# EAGLE design StellixR1 (EAGLE 9.2.0)
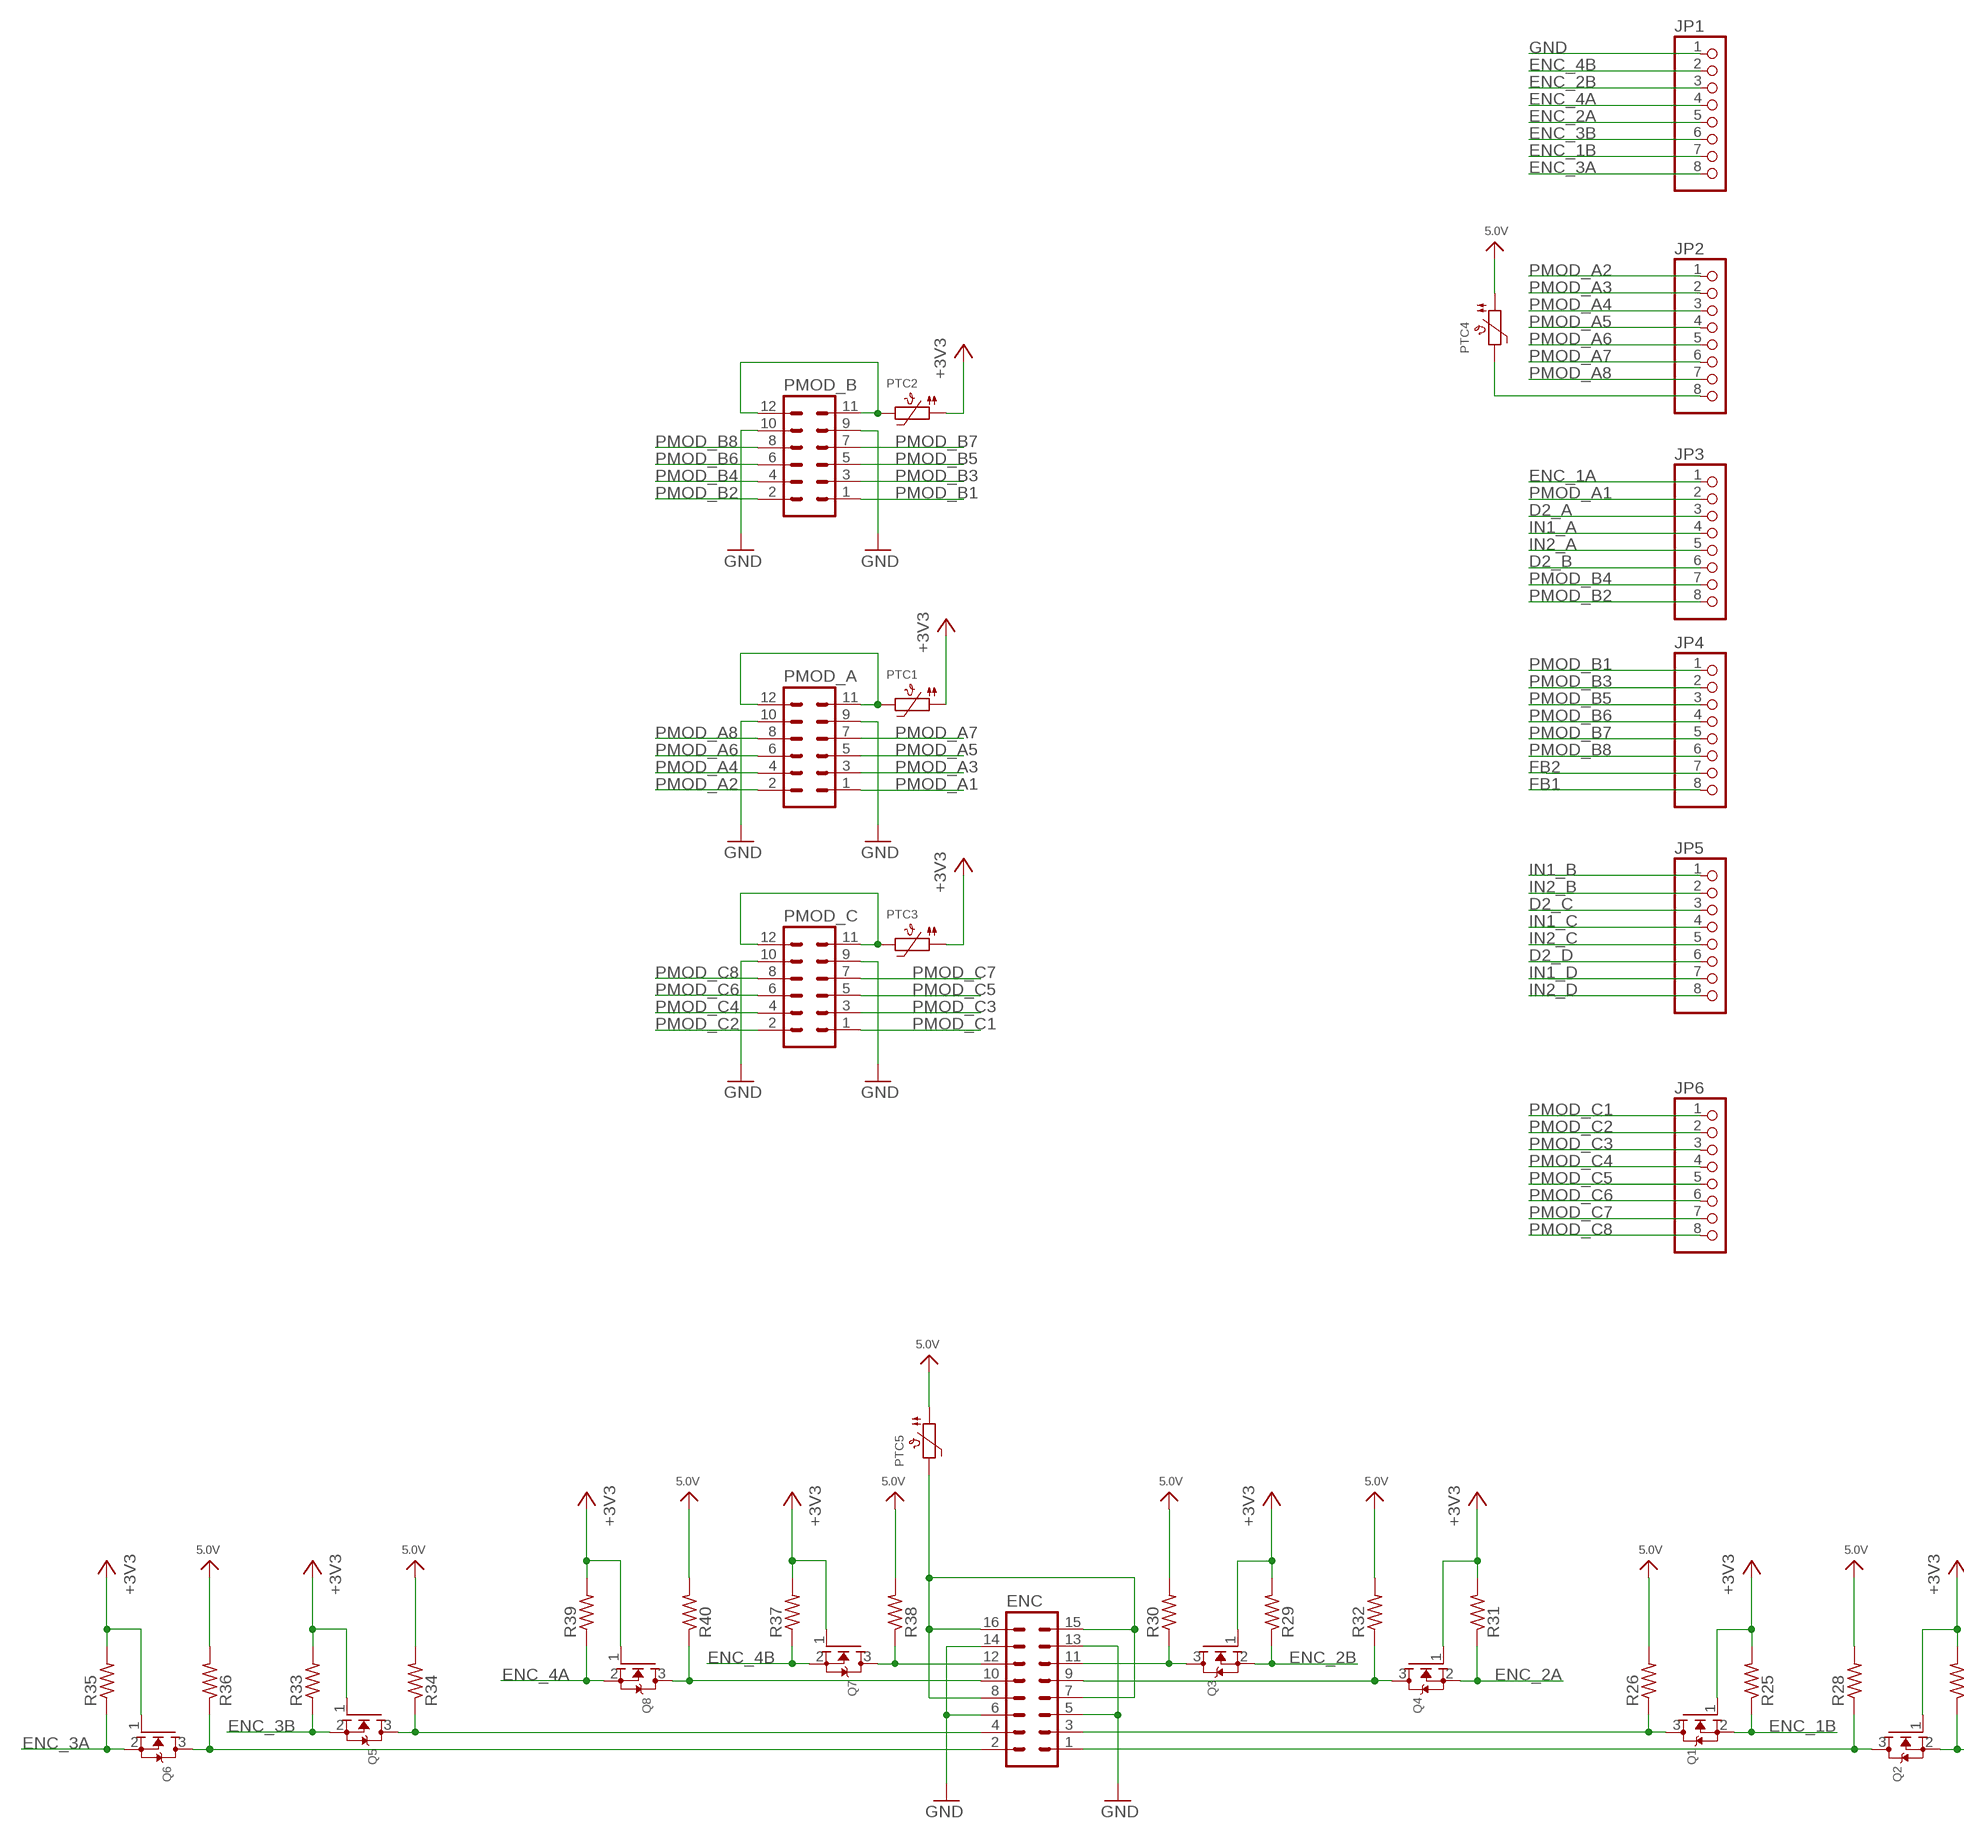
[diagram p0: schematic, sheet 1, part 1 of 3]
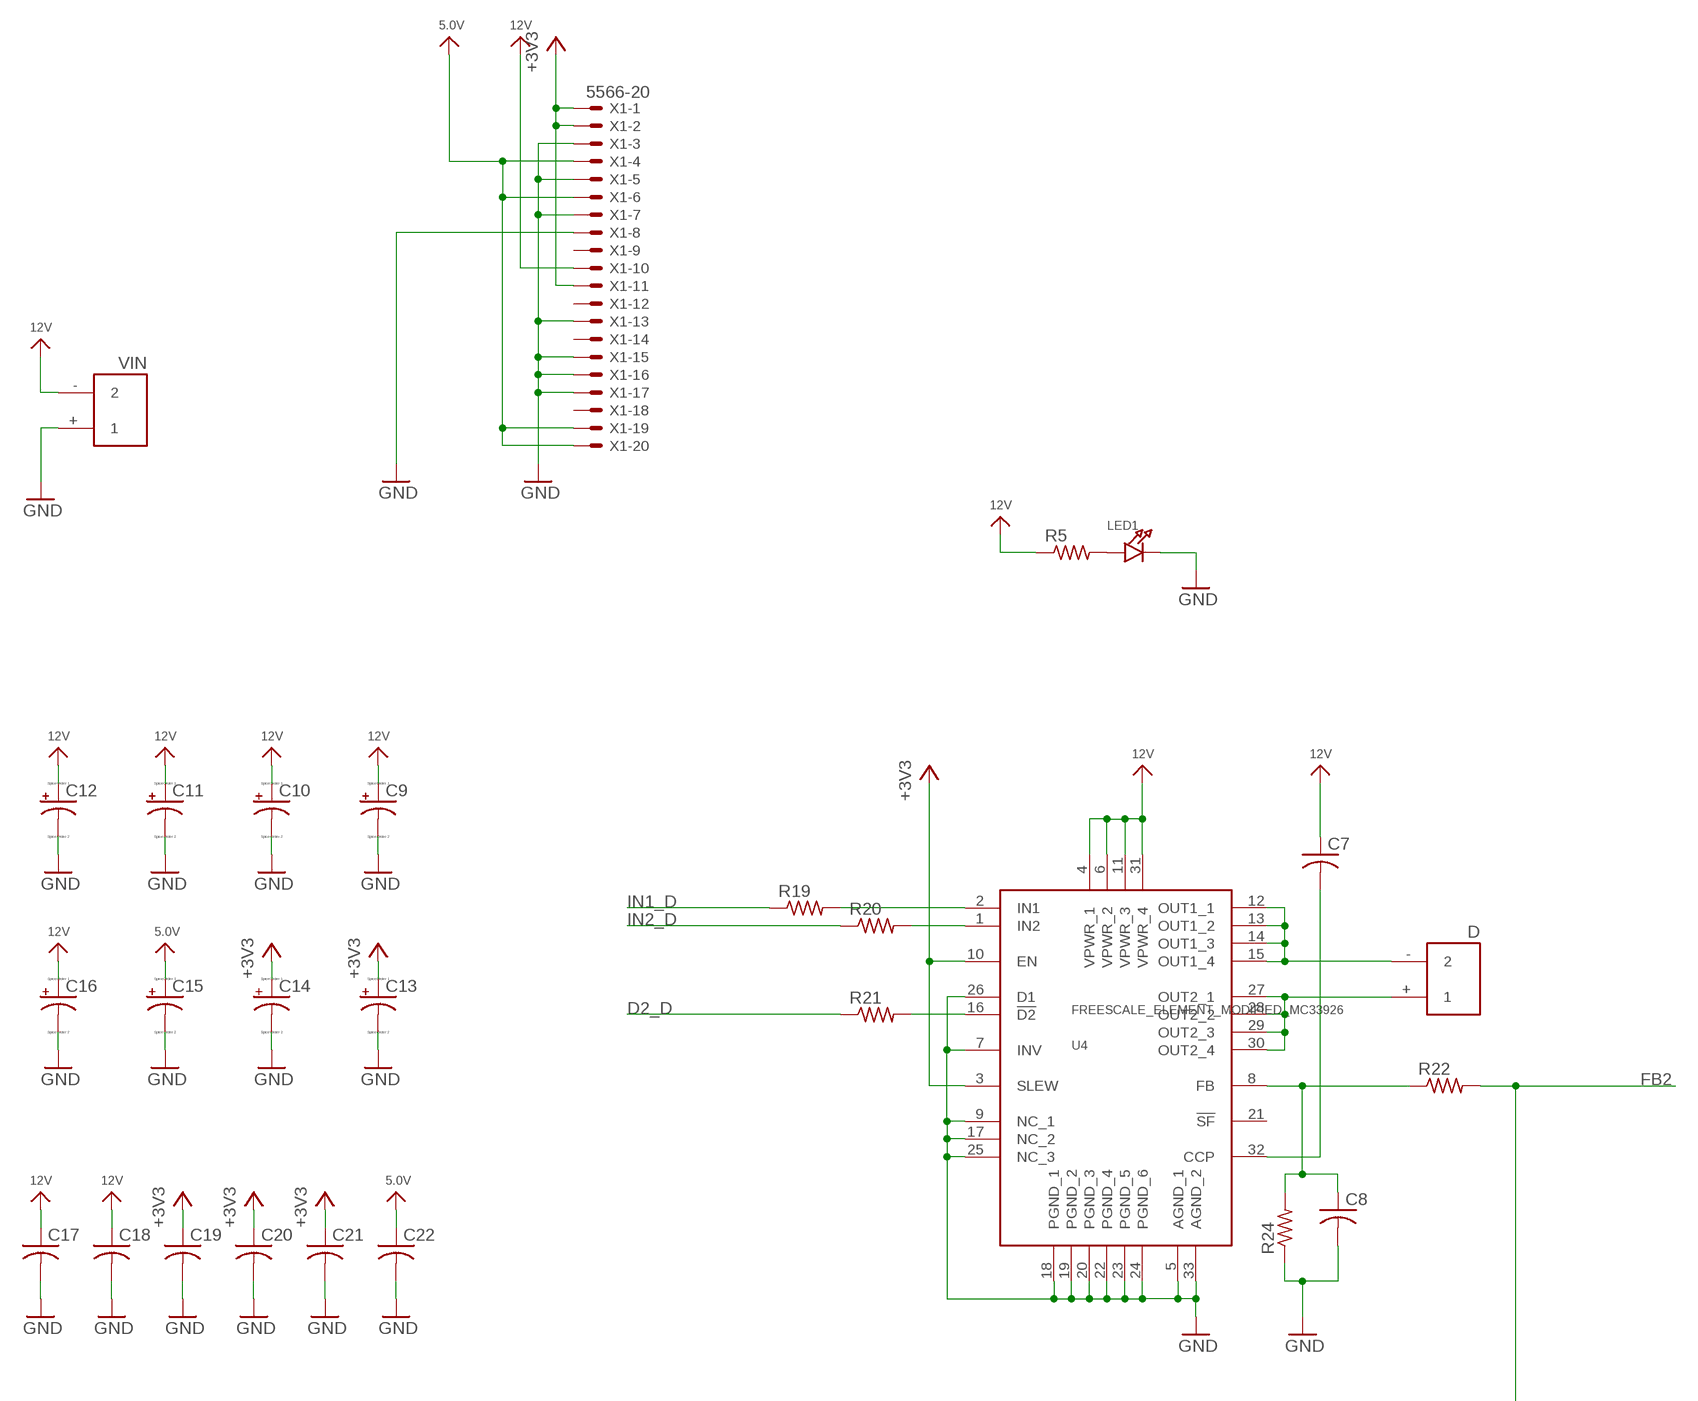
[diagram p1: schematic, sheet 1, part 2 of 3]
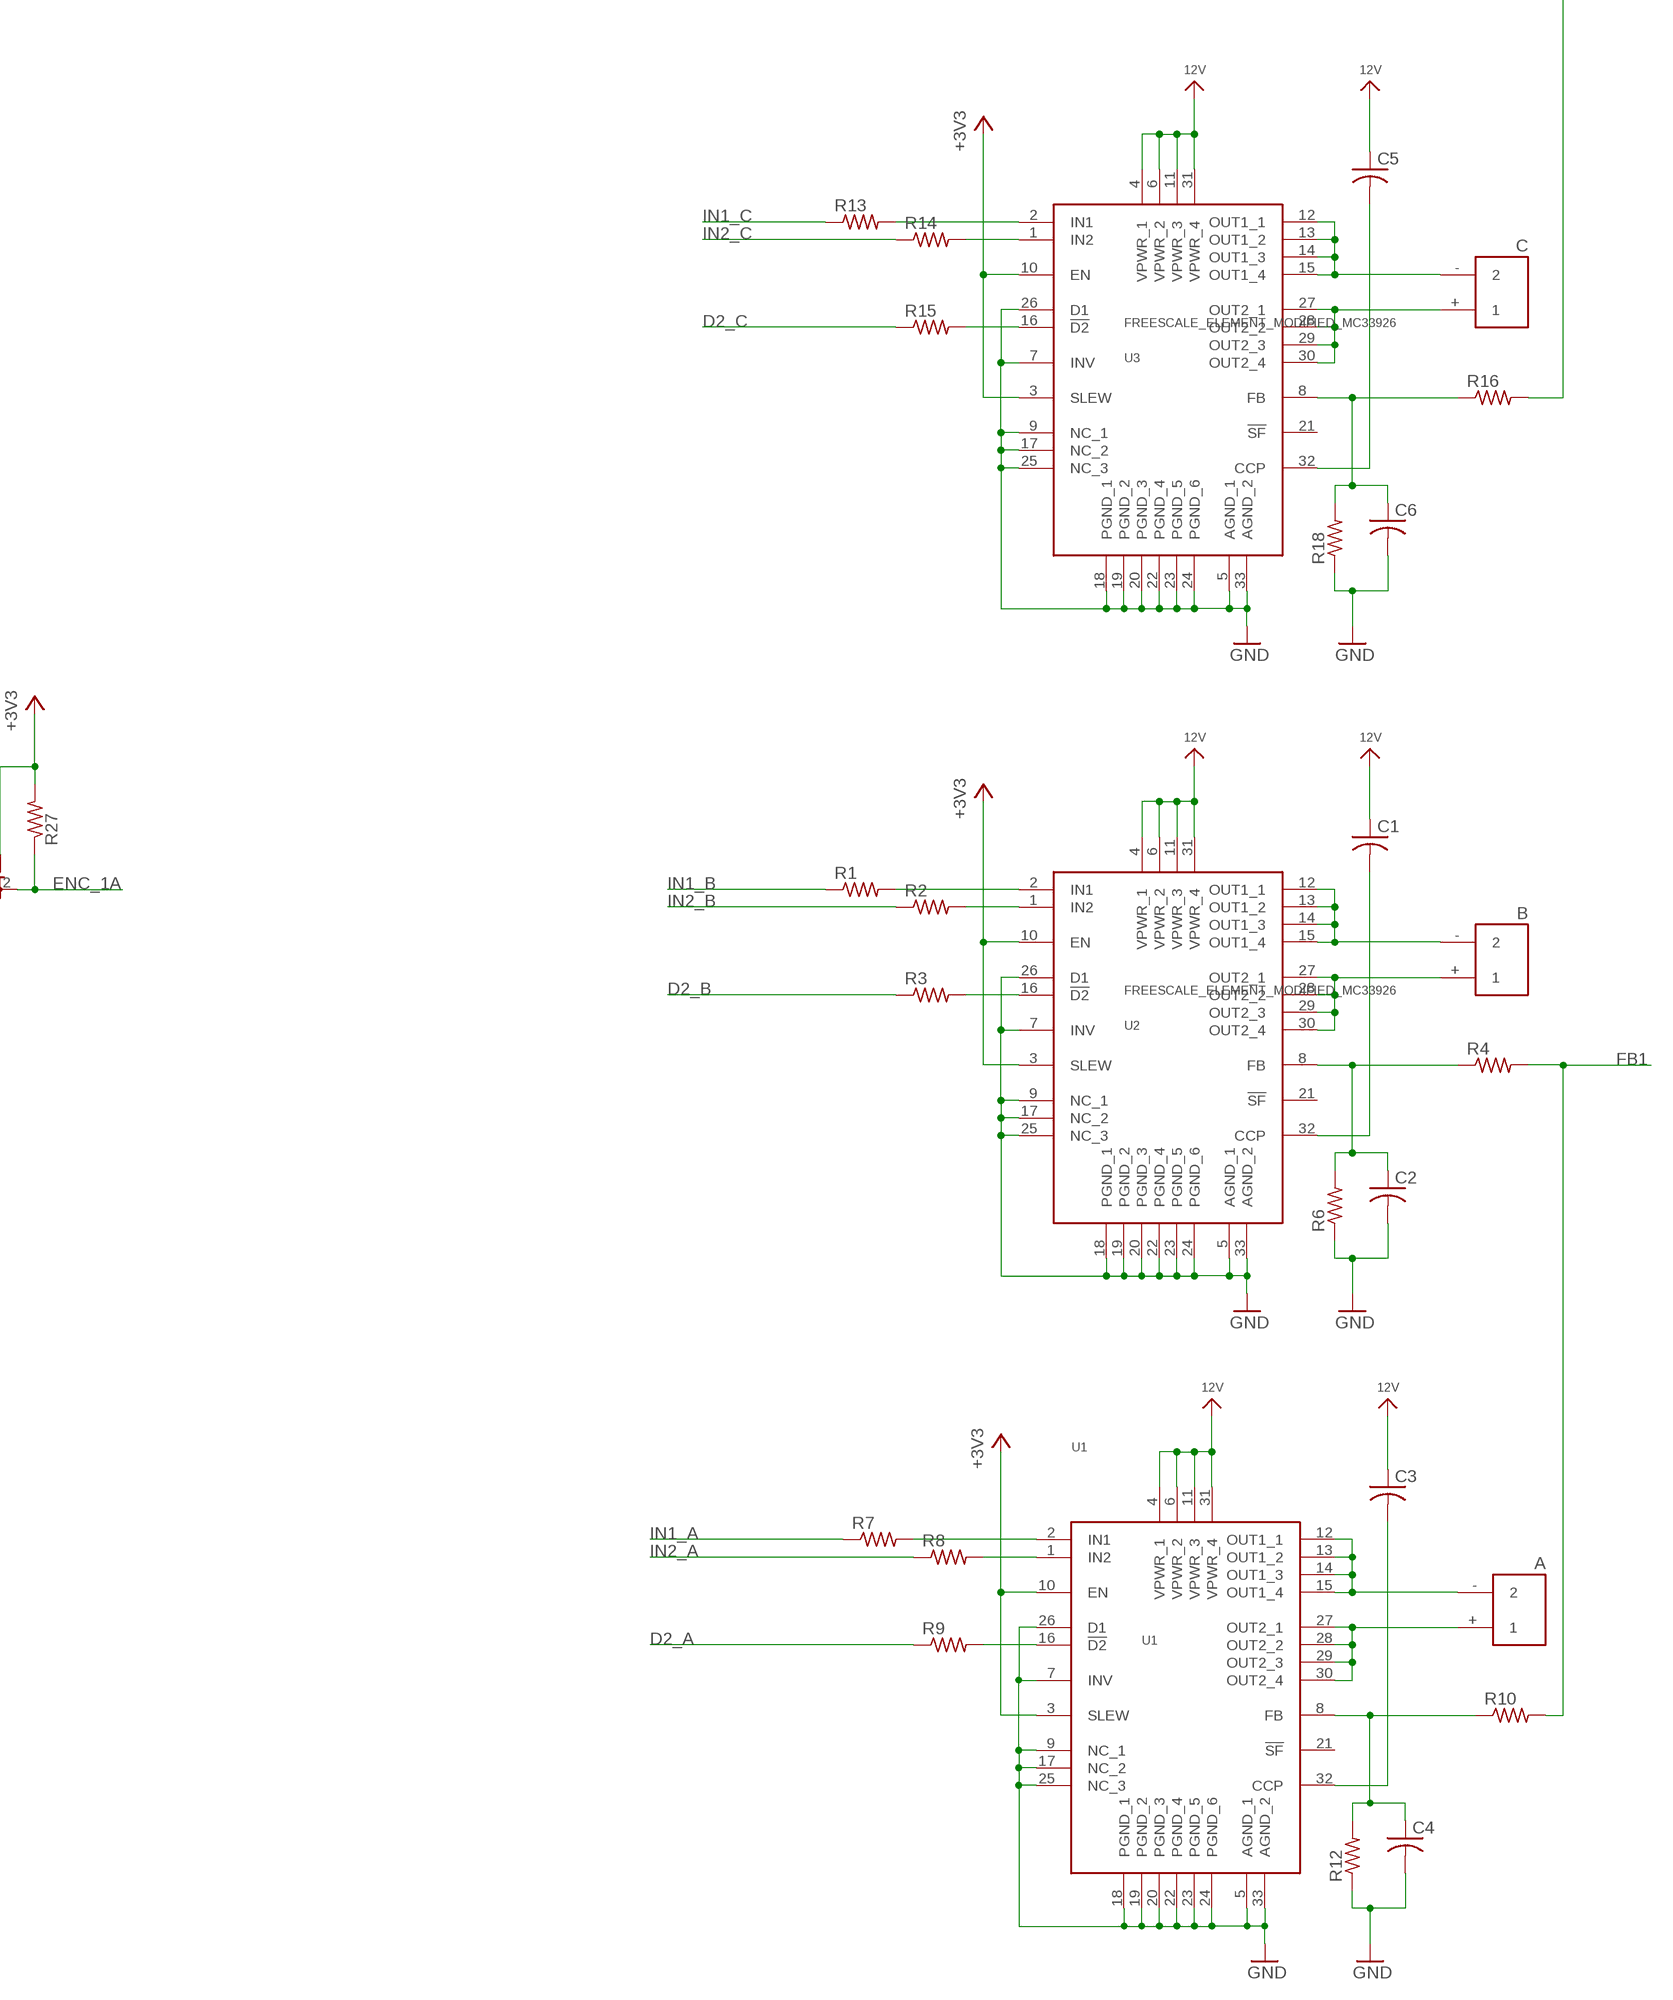
[diagram p2: schematic, sheet 1, part 3 of 3]

## Parts
A  XT60_FEMALE  [XT60_FEMALE]
B  XT60_FEMALE  [XT60_FEMALE]
C  XT60_FEMALE  [XT60_FEMALE]
C1  C-USC0805  [C0805]
C2  C-USC0805  [C0805]
C3  C-USC0805  [C0805]
C4  C-USC0805  [C0805]
C5  C-USC0805  [C0805]
C6  C-USC0805  [C0805]
C7  C-USC0805  [C0805]
C8  C-USC0805  [C0805]
C9  CPOL-US153CLV-0605  [153CLV-0605]
C10  CPOL-US153CLV-0605  [153CLV-0605]
C11  CPOL-US153CLV-0605  [153CLV-0605]
C12  CPOL-US153CLV-0605  [153CLV-0605]
C13  CPOL-US153CLV-0605  [153CLV-0605]
C14  CPOL-US153CLV-0605  [153CLV-0605]
C15  CPOL-US153CLV-0605  [153CLV-0605]
C16  CPOL-US153CLV-0605  [153CLV-0605]
C17  C-USC0805  [C0805]
C18  C-USC0805  [C0805]
C19  C-USC0805  [C0805]
C20  C-USC0805  [C0805]
C21  C-USC0805  [C0805]
C22  C-USC0805  [C0805]
D  XT60_FEMALE  [XT60_FEMALE]
ENC  MA08-2  [MA08-2]
JP1  HEADER-1X8ROUND  [1X08_ROUND]
JP2  HEADER-1X8ROUND  [1X08_ROUND]
JP3  HEADER-1X8ROUND  [1X08_ROUND]
JP4  HEADER-1X8ROUND  [1X08_ROUND]
JP5  HEADER-1X8ROUND  [1X08_ROUND]
JP6  HEADER-1X8ROUND  [1X08_ROUND]
LED1  LED0805_NOOUTLINE  [CHIPLED_0805_NOOUTLINE]
PMOD_A  MA06-2  [MA06-2]
PMOD_B  MA06-2  [MA06-2]
PMOD_C  MA06-2  [MA06-2]
PTC1  PTC1812  [PTC1812]
PTC2  PTC1812  [PTC1812]
PTC3  PTC1812  [PTC1812]
PTC4  PTC1812  [PTC1812]
PTC5  PTC1812  [PTC1812]
Q1  MOSFET-NWIDE  [SOT23-WIDE]
Q2  MOSFET-NWIDE  [SOT23-WIDE]
Q3  MOSFET-NWIDE  [SOT23-WIDE]
Q4  MOSFET-NWIDE  [SOT23-WIDE]
Q5  MOSFET-NWIDE  [SOT23-WIDE]
Q6  MOSFET-NWIDE  [SOT23-WIDE]
Q7  MOSFET-NWIDE  [SOT23-WIDE]
Q8  MOSFET-NWIDE  [SOT23-WIDE]
R1  R-US_R0805  [R0805]
R2  R-US_R0805  [R0805]
R3  R-US_R0805  [R0805]
R4  R-US_R0805  [R0805]
R5  R-US_R0805  [R0805]
R6  R-US_R0805  [R0805]
R7  R-US_R0805  [R0805]
R8  R-US_R0805  [R0805]
R9  R-US_R0805  [R0805]
R10  R-US_R0805  [R0805]
R12  R-US_R0805  [R0805]
R13  R-US_R0805  [R0805]
R14  R-US_R0805  [R0805]
R15  R-US_R0805  [R0805]
R16  R-US_R0805  [R0805]
R18  R-US_R0805  [R0805]
R19  R-US_R0805  [R0805]
R20  R-US_R0805  [R0805]
R21  R-US_R0805  [R0805]
R22  R-US_R0805  [R0805]
R24  R-US_R0805  [R0805]
R25  R-US_R0805  [R0805]
R26  R-US_R0805  [R0805]
R27  R-US_R0805  [R0805]
R28  R-US_R0805  [R0805]
R29  R-US_R0805  [R0805]
R30  R-US_R0805  [R0805]
R31  R-US_R0805  [R0805]
R32  R-US_R0805  [R0805]
R33  R-US_R0805  [R0805]
R34  R-US_R0805  [R0805]
R35  R-US_R0805  [R0805]
R36  R-US_R0805  [R0805]
R37  R-US_R0805  [R0805]
R38  R-US_R0805  [R0805]
R39  R-US_R0805  [R0805]
R40  R-US_R0805  [R0805]
U1  U1  FREESCALE_ELEMENT_MODIFIED_MC33926  [FREESCALE_ELEMENT_MODIFIED_PQFN32_0P8_8X8_SLUG]
U2  FREESCALE_ELEMENT_MODIFIED_MC33926  [FREESCALE_ELEMENT_MODIFIED_PQFN32_0P8_8X8_SLUG]
U3  FREESCALE_ELEMENT_MODIFIED_MC33926  [FREESCALE_ELEMENT_MODIFIED_PQFN32_0P8_8X8_SLUG]
U4  FREESCALE_ELEMENT_MODIFIED_MC33926  [FREESCALE_ELEMENT_MODIFIED_PQFN32_0P8_8X8_SLUG]
VIN  XT60_FEMALE  [XT60_FEMALE]
X1  5566-20  [5566-20]

## Nets
5.0V: C15.+ C22.1 PTC4.P$1 PTC5.P$1 R26.2 R28.2 R30.2 R32.2 R34.2 R36.2 R38.2 R40.2 X1.4 X1.6 X1.19 X1.20
12V: C1.1 C3.1 C5.1 C7.1 C9.+ C10.+ C11.+ C12.+ C16.+ C17.1 C18.1 R5.1 U1.4(VPWR_1) U1.6(VPWR_2) U1.11(VPWR_3) U1.31(VPWR_4) U2.4(VPWR_1) U2.6(VPWR_2) U2.11(VPWR_3) U2.31(VPWR_4) U3.4(VPWR_1) U3.6(VPWR_2) U3.11(VPWR_3) U3.31(VPWR_4) U4.4(VPWR_1) U4.6(VPWR_2) U4.11(VPWR_3) U4.31(VPWR_4) VIN.- X1.10
+3V3: C13.+ C14.+ C19.1 C20.1 C21.1 PTC1.P$1 PTC2.P$1 PTC3.P$1 Q1.1(G) Q2.1(G) Q3.1(G) Q4.1(G) Q5.1(G) Q6.1(G) Q7.1(G) Q8.1(G) R25.2 R27.2 R29.2 R31.2 R33.2 R35.2 R37.2 R39.2 U1.3(SLEW) U1.10(EN) U2.3(SLEW) U2.10(EN) U3.3(SLEW) U3.10(EN) U4.3(SLEW) U4.10(EN) X1.1 X1.2 X1.11
D2_A: JP3.3 R9.1
D2_B: JP3.6 R3.1
D2_C: JP5.3 R15.1
D2_D: JP5.6 R21.1
ENC_1A: JP3.1 Q2.2(S) R27.1
ENC_1B: JP1.7 Q1.2(S) R25.1
ENC_2A: JP1.5 Q4.2(S) R31.1
ENC_2B: JP1.3 Q3.2(S) R29.1
ENC_3A: JP1.8 Q6.2(S) R35.1
ENC_3B: JP1.6 Q5.2(S) R33.1
ENC_4A: JP1.4 Q8.2(S) R39.1
ENC_4B: JP1.2 Q7.2(S) R37.1
FB1: JP4.8 R4.2 R10.2
FB2: JP4.7 R16.2 R22.2
GND: C2.2 C4.2 C6.2 C8.2 C9.- C10.- C11.- C12.- C13.- C14.- C15.- C16.- C17.2 C18.2 C19.2 C20.2 C21.2 C22.2 ENC.5 ENC.6 ENC.13 ENC.14 JP1.1 LED1.C PMOD_A.9 PMOD_A.10 PMOD_B.9 PMOD_B.10 PMOD_C.9 PMOD_C.10 R6.1 R12.1 R18.1 R24.1 U1.5(AGND_1) U1.7(INV) U1.9(NC_1) U1.17(NC_2) U1.18(PGND_1) U1.19(PGND_2) U1.20(PGND_3) U1.22(PGND_4) U1.23(PGND_5) U1.24(PGND_6) U1.25(NC_3) U1.26(D1) U1.33(AGND_2) U2.5(AGND_1) U2.7(INV) U2.9(NC_1) U2.17(NC_2) U2.18(PGND_1) U2.19(PGND_2) U2.20(PGND_3) U2.22(PGND_4) U2.23(PGND_5) U2.24(PGND_6) U2.25(NC_3) U2.26(D1) U2.33(AGND_2) U3.5(AGND_1) U3.7(INV) U3.9(NC_1) U3.17(NC_2) U3.18(PGND_1) U3.19(PGND_2) U3.20(PGND_3) U3.22(PGND_4) U3.23(PGND_5) U3.24(PGND_6) U3.25(NC_3) U3.26(D1) U3.33(AGND_2) U4.5(AGND_1) U4.7(INV) U4.9(NC_1) U4.17(NC_2) U4.18(PGND_1) U4.19(PGND_2) U4.20(PGND_3) U4.22(PGND_4) U4.23(PGND_5) U4.24(PGND_6) U4.25(NC_3) U4.26(D1) U4.33(AGND_2) VIN.+ X1.3 X1.5 X1.7 X1.8 X1.13 X1.15 X1.16 X1.17
IN1_A: JP3.4 R7.1
IN1_B: JP5.1 R1.1
IN1_C: JP5.4 R13.1
IN1_D: JP5.7 R19.1
IN2_A: JP3.5 R8.1
IN2_B: JP5.2 R2.1
IN2_C: JP5.5 R14.1
IN2_D: JP5.8 R20.1
MOUTA: B.- U2.12(OUT1_1) U2.13(OUT1_2) U2.14(OUT1_3) U2.15(OUT1_4)
MOUTB: B.+ U2.27(OUT2_1) U2.28(OUT2_2) U2.29(OUT2_3) U2.30(OUT2_4)
N$1: R3.2 U2.16(!D2)
N$2: JP2.8 PTC4.P$2
N$3: PMOD_A.11 PMOD_A.12 PTC1.P$2
N$4: R8.2 U1.1(IN2)
N$5: PMOD_C.11 PMOD_C.12 PTC3.P$2
N$6: R2.2 U2.1(IN2)
N$7: R1.2 U2.2(IN1)
N$8: ENC.1 Q2.3(D) R28.1
N$9: ENC.4 Q5.3(D) R34.1
N$10: R7.2 U1.2(IN1)
N$11: PMOD_B.11 PMOD_B.12 PTC2.P$2
N$12: C1.2 U2.32(CCP)
N$13: A.- U1.12(OUT1_1) U1.13(OUT1_2) U1.14(OUT1_3) U1.15(OUT1_4)
N$14: C2.1 R4.1 R6.2 U2.8(FB)
N$15: ENC.7 ENC.8 ENC.15 ENC.16 PTC5.P$2
N$16: LED1.A R5.2
N$17: A.+ U1.27(OUT2_1) U1.28(OUT2_2) U1.29(OUT2_3) U1.30(OUT2_4)
N$19: C3.2 U1.32(CCP)
N$20: R9.2 U1.16(!D2)
N$24: C4.1 R10.1 R12.2 U1.8(FB)
N$27: R14.2 U3.1(IN2)
N$28: R13.2 U3.2(IN1)
N$29: C.- U3.12(OUT1_1) U3.13(OUT1_2) U3.14(OUT1_3) U3.15(OUT1_4)
N$30: C.+ U3.27(OUT2_1) U3.28(OUT2_2) U3.29(OUT2_3) U3.30(OUT2_4)
N$32: C5.2 U3.32(CCP)
N$33: R15.2 U3.16(!D2)
N$37: C6.1 R16.1 R18.2 U3.8(FB)
N$40: R20.2 U4.1(IN2)
N$41: R19.2 U4.2(IN1)
N$42: D.- U4.12(OUT1_1) U4.13(OUT1_2) U4.14(OUT1_3) U4.15(OUT1_4)
N$43: D.+ U4.27(OUT2_1) U4.28(OUT2_2) U4.29(OUT2_3) U4.30(OUT2_4)
N$45: C7.2 U4.32(CCP)
N$46: R21.2 U4.16(!D2)
N$50: C8.1 R22.1 R24.2 U4.8(FB)
N$53: ENC.3 Q1.3(D) R26.1
N$54: ENC.2 Q6.3(D) R36.1
N$55: ENC.11 Q3.3(D) R30.1
N$56: ENC.9 Q4.3(D) R32.1
N$57: ENC.12 Q7.3(D) R38.1
N$58: ENC.10 Q8.3(D) R40.1
PMOD_A1: JP3.2 PMOD_A.1
PMOD_A2: JP2.1 PMOD_A.2
PMOD_A3: JP2.2 PMOD_A.3
PMOD_A4: JP2.3 PMOD_A.4
PMOD_A5: JP2.4 PMOD_A.5
PMOD_A6: JP2.5 PMOD_A.6
PMOD_A7: JP2.6 PMOD_A.7
PMOD_A8: JP2.7 PMOD_A.8
PMOD_B1: JP4.1 PMOD_B.1
PMOD_B2: JP3.8 PMOD_B.2
PMOD_B3: JP4.2 PMOD_B.3
PMOD_B4: JP3.7 PMOD_B.4
PMOD_B5: JP4.3 PMOD_B.5
PMOD_B6: JP4.4 PMOD_B.6
PMOD_B7: JP4.5 PMOD_B.7
PMOD_B8: JP4.6 PMOD_B.8
PMOD_C1: JP6.1 PMOD_C.1
PMOD_C2: JP6.2 PMOD_C.2
PMOD_C3: JP6.3 PMOD_C.3
PMOD_C4: JP6.4 PMOD_C.4
PMOD_C5: JP6.5 PMOD_C.5
PMOD_C6: JP6.6 PMOD_C.6
PMOD_C7: JP6.7 PMOD_C.7
PMOD_C8: JP6.8 PMOD_C.8
Unconnected: U1.21(!SF) U2.21(!SF) U3.21(!SF) U4.21(!SF) X1.9 X1.12 X1.14 X1.18

## Library data of the parts
A B C D VIN = Tristan+Robitaille's+Library:XT60_FEMALE: Vertical Mount Through-Hole Female (receptacle) XT60 Connector
C1-C8 C17-C22 = resistor:C-US: CAPACITOR, American symbol
C9-C16 = resistor:CPOL-US: POLARIZED CAPACITOR, American symbol
ENC = con-lstb:MA08-2: PIN HEADER; OC_FARNELL: unknown; OC_NEWARK: unknown
JP1-JP6 = microbuilder:HEADER-1X8: PIN HEADER
LED1 = microbuilder:LED: LED 0603 - 0603 Surface Mount Package 2mA: Green LED - Low Power (3.9mcd, 2ma, 1.7Vf) - Digikey: 475-2709-2-ND Orange LED - Low Power (9.8mcd, 2ma, 1.8Vf) - Digikey: 475-1194-2-ND Red LED - Low Power (5mcd, 2ma, 1.8Vf) - Digikey: 475-1195-2-ND Yellow LED - Low Power (7mcd, 2ma, 1.8Vf) - Digikey: 475-1196-2-ND 5mA: Blue LED - Low Power (17mcd, 5ma, 2.9Vf) - Digikey: LNJ937W8CRACT-ND 0805 - 0805 Surface Mount Package 2mA: Red LED (8.8mcd, 2mA, 1.8Vf, Clear) - Low Power [Digikey: 475-2510-1-ND] Green LED (5mcd, 2mA, 1.8Vf, Clear) - Low Power [Digikey: 475-2730-1-ND] Yellow LED (11.3mcd, 2mA, 1.8Vf, Clear) - Low Power [Digikey: 475-2555-1-ND] 20mA: Red LED (104mcd, 20mA, Diffused) - LS R976 [Digikey: 475-1278-6-ND] Red LED (12mcd, 20mA, 2.0Vf, Clear) - APT2012EC [Digikey: 754-1128-1-ND] Green LED (15mcd, 20mA, 2.2Vf, Clear) - APT2012GC [Digikey: 754-1131-1-ND] Orange LED (160mcd, 20mA, 2.1Vf, Clear) - APT2012SECK [Digikey: 754-1130-1-ND] 1206 - 1206 Surface Mount Package Green LED (26mcd, 20mA, Diffused) - LG N971 [Digikey: 475-1407-6-ND] Red LED (15mcd, 20mA, Diffused) - LH N974 [Digikey: 475-1416-6-ND]
PMOD_A PMOD_B PMOD_C = con-lstb:MA06-2: PIN HEADER; OC_FARNELL: unknown; OC_NEWARK: unknown
PTC1-PTC5 = microbuilder:PTC: PTC (Resettable Fuse) 1206 Package 250mA PTC (16V Max, Time-to-Trip: 0.08s) - Digikey: F2110CT-ND 1210 Package 100mA PTC (30V Max, Time-to-Trip: 0.6s) - Digikey: MF-USMF010-2CT-ND 1812 Package 750mA PTC (24V Max, Time-to-Trip: 0.2s) - Digikey: MF-MSMF075/24-2CT-ND
Q1-Q8 = microbuilder:MOSFET-N: N-Channel Mosfet LEGEND VDS: Voltage Drain-Source ID: Drain Current RDS(ON): Drain-Source On-State Resistance VGS(TH): Gate-Source Threshold Voltage CISS: Drain-Source Input Capacitance SOT-23 Name VDS ID RDS(ON) VGS(TH) CISS Order Number 2N7002E 60V 260mA 2.5 Ohm 2.5V @ 250uA 26.7pF @ 25V 2N7002ET1GOSTR-ND BSH103 30V 850mA 400 mOhm 400mV @ 1mA 83pF @ 24V BSH103,235-ND BSS138 60V 320mA 1.6 Ohm 1.5V @ 250uA 50pF @ 10V Mouser: 771-BSS138PW115 DMN2075U-7 20V 4.2A 38 mOhm 1V @ 250 uA 594.3pF @ 10V DMN2075U-7DICT-ND * BSS138 good choice for I2C level-shifting
R1-R10 R12-R16 R18-R22 R24-R40 = resistor:R-US_: RESISTOR, American symbol
U1-U4 = MC33926 Bare Board:FREESCALE_ELEMENT_MODIFIED_MC33926
X1 = con-molex:5566-20: Mini FIT connector 20 pol ATX PC-Motherboard Power connector Source: http://www.molex.com; MF: MOLEX; OC_FARNELL: unknown; OC_NEWARK: unknown

## Board
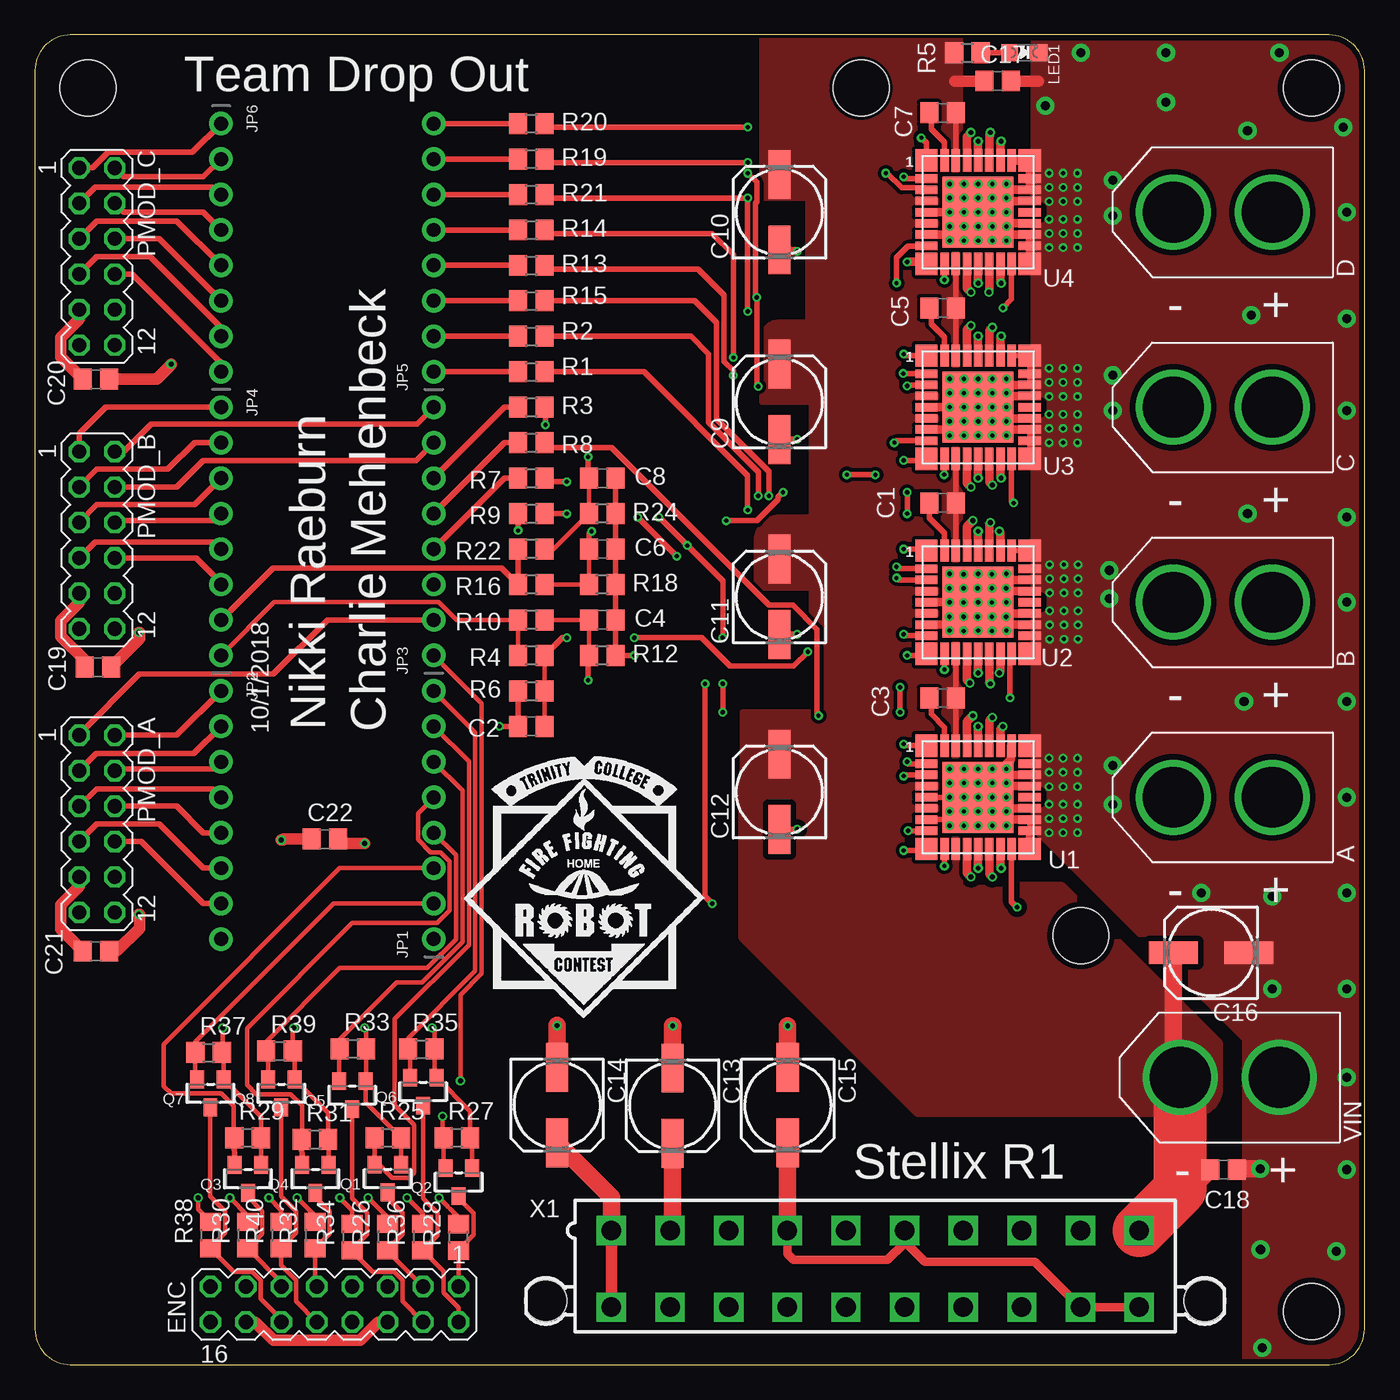
[diagram p3: board, top side]
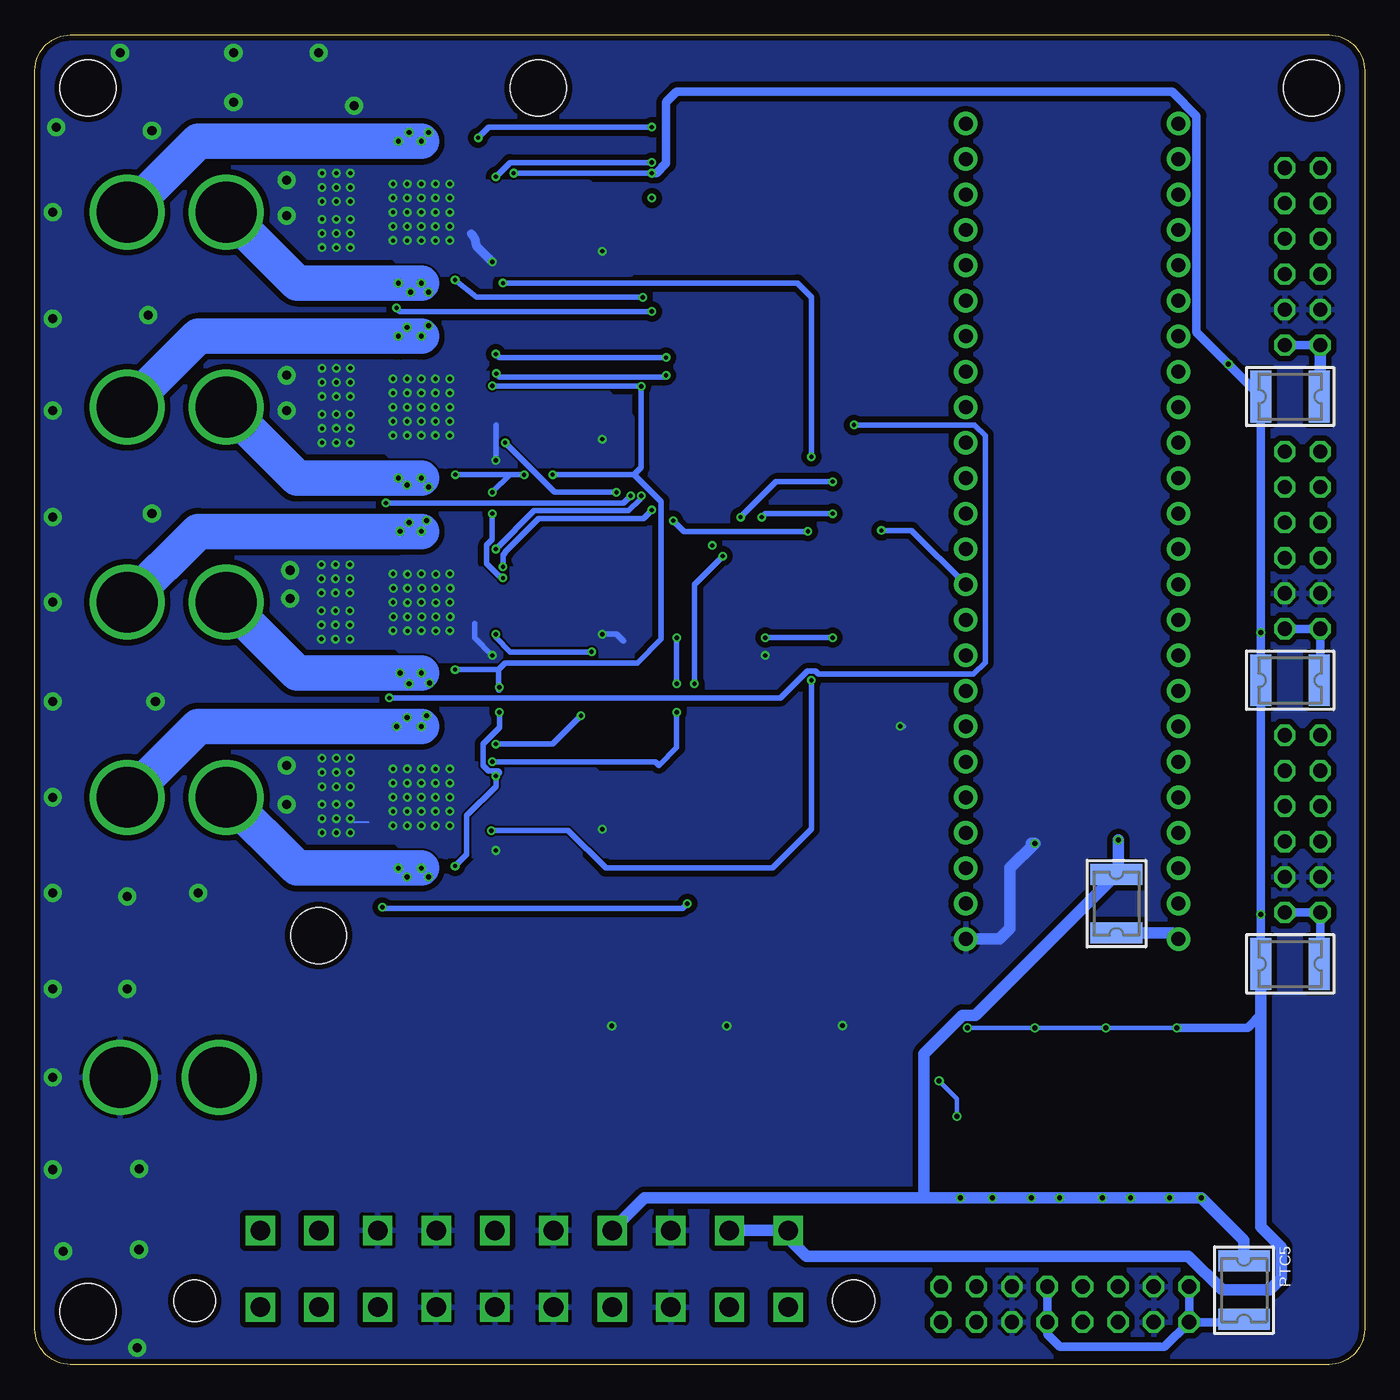
[diagram p4: board, bottom side, seen from below]

Size 95.25 x 95.25 mm. Coordinates in mm from the lower left corner, seen from the top.
Outline: 0,92.71 0,2.54 arc90 2.54,0 92.71,0 arc90 95.25,2.54 95.25,92.71 arc90 92.71,95.25 2.54,95.25 arc90 0,92.71
Copper layers (1*16): Top 0.035mm / dielectric 1.5mm / Bottom 0.035mm
Design rules "dirt_cheap_dirty_boards.v1.1": minimum track width 6mil, minimum drill 12mil, track to track 6mil, track to pad 6mil, pad to pad 6mil, via to via 6mil, smd to smd 0mil, copper to edge 10mil, drill to drill 10mil, minimum pad ring 10mil, minimum via ring 6mil, stop-mask expansion 2mil, vias tented up to drill 25mil, thermal gap 10mil
Holes 4 mm at 91.44,91.44 3.81,91.44 91.44,3.81 59.18,91.44 74.93,30.73

### Footprints (pad centres in the part's own frame; a part is rotated, then mirrored left to right if it is on the bottom)
XT60_FEMALE = drill 4.35: + 3.55,0; - -3.55,0
C0805 = smd 1.3 x 1.5: 1 -0.95,0; 2 0.95,0
153CLV-0605 = smd 3.5 x 1.6: + 2.7,0; - -2.7,0
MA08-2 = drill 1.016 octagon: 1 -8.89,-1.27; 2 -8.89,1.27; 3 -6.35,-1.27; 4 -6.35,1.27; 5 -3.81,-1.27; 6 -3.81,1.27; 7 -1.27,-1.27; 8 -1.27,1.27; 9 1.27,-1.27; 10 1.27,1.27; 11 3.81,-1.27; 12 3.81,1.27; 13 6.35,-1.27; 14 6.35,1.27; 15 8.89,-1.27; 16 8.89,1.27
1X08_ROUND = drill 1 pad 1.676: 1 -8.89,0; 2 -6.35,0; 3 -3.81,0; 4 -1.27,0; 5 1.27,0; 6 3.81,0; 7 6.35,0; 8 8.89,0
CHIPLED_0805_NOOUTLINE = smd 1.2 x 1.2: A 0,-1.05; C 0,1.05
MA06-2 = drill 1.016 octagon: 1 -6.35,-1.27; 2 -6.35,1.27; 3 -3.81,-1.27; 4 -3.81,1.27; 5 -1.27,-1.27; 6 -1.27,1.27; 7 1.27,-1.27; 8 1.27,1.27; 9 3.81,-1.27; 10 3.81,1.27; 11 6.35,-1.27; 12 6.35,1.27
PTC1812 = smd 1.5 x 3.7: P$1 -2.1,0; P$2 2.1,0
SOT23-WIDE = smd 1 x 1.27: 1 -0.95,-1; 2 0.95,-1; 3 0,1
R0805 = smd 1.3 x 1.5: 1 -0.95,0; 2 0.95,0
FREESCALE_ELEMENT_MODIFIED_PQFN32_0P8_8X8_SLUG = smd 1.6 x 1.6: 1 -3.7,3.7; 9 -3.7,-3.7; 17 3.7,-3.7; 25 3.7,3.7 | smd 1.6 x 0.61: 2 -3.7,2.4; 3 -3.7,1.6; 4 -3.7,0.8; 5 -3.7,0; 6 -3.7,-0.8; 7 -3.7,-1.6; 8 -3.7,-2.4; 18 3.7,-2.4; 19 3.7,-1.6; 20 3.7,-0.8; 21 3.7,0; 22 3.7,0.8; 23 3.7,1.6; 24 3.7,2.4 | smd 0.61 x 1.6: 10 -2.4,-3.7; 11 -1.6,-3.7; 12 -0.8,-3.7; 13 0,-3.7; 14 0.8,-3.7; 15 1.6,-3.7; 16 2.4,-3.7; 26 2.4,3.7; 27 1.6,3.7; 28 0.8,3.7; 29 0,3.7; 30 -0.8,3.7; 31 -1.6,3.7; 32 -2.4,3.7 | smd 5.08 x 5.08: 33 0,0
5566-20 = drill 1.4 square: 1 18.9,-2.75; 2 14.7,-2.75; 3 10.5,-2.75; 4 6.3,-2.75; 5 2.1,-2.75; 6 -2.1,-2.75; 7 -6.3,-2.75; 8 -10.5,-2.75; 9 -14.7,-2.75; 10 -18.9,-2.75; 11 18.9,2.75; 12 14.7,2.75; 13 10.5,2.75; 14 6.3,2.75; 15 2.1,2.75; 16 -2.1,2.75; 17 -6.3,2.75; 18 -10.5,2.75; 19 -14.7,2.75; 20 -18.9,2.75 | hole 3: 23.6,2.29; -23.6,2.29

### Placement (x,y rotation side)
A  85.09,40.64 0 top
B  85.09,54.61 0 top
C  85.09,68.58 0 top
C1  65.02,61.72 180 top
C2  35.56,45.72 180 top
C3  65.02,47.75 180 top
C4  40.64,53.34 0 top
C5  65.02,75.69 180 top
C6  40.64,58.42 0 top
C7  65.02,89.66 180 top
C8  40.64,63.5 0 top
C9  53.34,68.96 90 top
C10  53.34,82.55 90 top
C11  53.34,54.99 90 top
C12  53.34,41.02 90 top
C13  45.67,18.54 270 top
C14  37.4,18.59 270 top
C15  53.92,18.59 270 top
C16  84.25,29.5 180 top
C17  68.96,91.95 0 top
C18  85.15,13.97 0 top
C19  4.51,49.96 180 top
C20  4.38,70.59 180 top
C21  4.38,29.62 180 top
C22  20.76,37.64 0 top
D  85.09,82.55 0 top
ENC  21.46,4.32 180 top
JP1  28.57,39.37 90 top
JP2  13.34,39.37 270 top
JP3  28.57,59.69 90 top
JP4  13.34,59.69 270 top
JP5  28.57,80.01 90 top
JP6  13.34,80.01 270 top
LED1  70.87,93.98 270 top
PMOD_A  4.45,38.73 270 top
PMOD_B  4.45,59.05 270 top
PMOD_C  4.45,79.38 270 top
PTC1  5.33,28.7 0 bottom
PTC2  5.33,49.02 0 bottom
PTC3  5.33,69.34 0 bottom
PTC4  17.78,33.02 270 bottom
PTC5  8.64,5.33 270 bottom
Q1  25.27,13.34 180 top
Q2  30.35,13.08 180 top
Q3  15.27,13.31 180 top
Q4  20.09,13.31 180 top
Q5  22.73,19.3 180 top
Q6  27.81,19.56 180 top
Q7  12.57,19.43 180 top
Q8  17.65,19.43 180 top
R1  35.56,71.12 0 top
R2  35.56,73.66 0 top
R3  35.56,68.58 0 top
R4  35.56,50.8 180 top
R5  66.8,93.98 0 top
R6  35.56,48.26 0 top
R7  35.56,63.5 0 top
R8  35.56,66.04 0 top
R9  35.56,60.96 0 top
R10  35.56,53.34 180 top
R12  40.64,50.8 180 top
R13  35.56,78.74 0 top
R14  35.56,81.28 0 top
R15  35.56,76.2 0 top
R16  35.56,55.88 180 top
R18  40.64,55.88 180 top
R19  35.56,86.36 0 top
R20  35.56,88.9 0 top
R21  35.56,83.82 0 top
R22  35.56,58.42 180 top
R24  40.64,60.96 180 top
R25  25.27,16.26 0 top
R26  25.27,9.14 90 top
R27  30.23,16.26 0 top
R28  30.35,9.12 90 top
R29  15.24,16.26 0 top
R30  15.24,9.27 90 top
R31  20.07,16.13 0 top
R32  20.07,9.27 90 top
R33  22.78,22.63 0 top
R34  22.73,9.14 90 top
R35  27.69,22.61 0 top
R36  27.79,9.14 90 top
R37  12.45,22.35 0 top
R38  12.57,9.27 90 top
R39  17.53,22.48 0 top
R40  17.65,9.27 90 top
U1  67.56,40.64 0 top
U2  67.56,54.61 0 top
U3  67.56,68.58 0 top
U4  67.56,82.55 0 top
VIN  85.6,20.57 0 top
X1  60.2,6.86 180 top

### Tracks (layer width: path | path; a pad name or v marks a point on that pad's centre or on a via)
5.0V  (via drill 0.35)
  Top 0.305: R38.2 11.68,11.11 v11.68,11.94 | v13.97,11.94 15.24,10.67 R30.2 | v16.76,11.94 17.65,11.05 R40.2 | v18.8,11.94 20.07,10.67 R32.2 | v21.84,11.94 22.73,11.05 R34.2 | v23.88,11.94 25.27,10.54 R26.2 | v26.67,11.94 27.79,10.82 R36.2 | R28.2 30.35,10.54 29.75,11.14 29.73,11.14 29.55,11.32 29.55,11.35 v28.96,11.94
  Top 0.61: X1.20 X1.19 71.64,7.37 63.75,7.37 62.3,8.82 X1.6 62.3,8.7 61.09,7.49 54.36,7.49 53.9,7.95 X1.4
  Top 0.813: C22.1 17.83,37.64 17.78,37.59 v17.65,37.59
  Top 1.27: C15.+ 53.92,9.63 X1.4
  Bottom 0.813: X1.4 51.57,11.94 31.59,11.94 | 31.59,11.94 v28.96,11.94 v26.67,11.94 v23.88,11.94 v21.84,11.94 v18.8,11.94 v16.76,11.94 v13.97,11.94 v11.68,11.94 8.64,8.89 PTC5.P$1 | 31.59,11.94 31.59,22.25 28.82,25.02 27.88,25.02 PTC4.P$1 17.65,35.25 v17.65,37.59
12V
  Top 0.406: 65.96,75.45 C5.1 | U4.31 C7.1 | 65.96,75.45 U3.31 | U2.31 C1.1 65.96,61.73 U3.11 | U1.31 C3.1 65.97,50.9 U2.11 | U4.11 C5.1 | C5.1 65.96,75.45
  Top 0.813: C17.1 65.91,91.95
  Top 1.27: C16.+ 81.55,21.07 VIN.- | C18.1 82.79,12.56 82.05,12.56
  Top 3.81: X1.10 82.05,12.56 VIN.-
  Bottom 0.813: 81.64,20.16 VIN.-
  pour Top (isolate 0.254, no thermals): 66.29,34.29 66.29,95.76 52.07,95.76 52.07,83.57 55.37,83.57 55.37,74.68 53.34,74.68 arc90 52.07,73.41 52.07,68.96 55.63,68.96 55.63,60.71 53.34,60.71 arc90 51.69,59.05 51.69,55.63 55.63,55.63 55.63,46.74 50.67,46.74 50.67,41.66 61.21,41.66 61.21,35.56 arc90 62.48,34.29
  pour Top (isolate 0.406, no thermals): 63.25,18.03 83.06,18.03 arc90 84.8,19.77 84.8,23.03 73.53,34.29 61.72,34.29 61.72,41.4 61.47,41.66 50.67,41.66 50.67,30.61
+3V3  (via drill 0.3, 0.35)
  Top 0.305: Q2.1 31.3,16.13 R27.2 31.18,18.14 Q6.1 28.64,20.68 R35.2 28.64,23.94 v28.45,24.13 | Q1.1 R25.2 23.68,18.8 Q5.1 23.73,20.36 R33.2 23.73,24.02 v23.62,24.13 | Q4.1 21.04,16.1 R31.2 21.02,18.02 Q8.1 18.6,22.35 R39.2 18.48,24.06 v18.54,24.13 | Q3.1 16.21,16.23 R29.2 16.19,17.76 Q7.1 13.52,22.23 R37.2 13.46,22.42 v13.46,24.13
  Top 0.406: U4.10 65.16,77.73 v65.15,77.7 | v51.05,85.34 51.71,84.68 51.71,83.29 51.61,83.19 51.61,76.45 v51.71,76.45 51.71,70.21 51.82,70.1 v51.82,70.08 | U4.3 63.72,84.29 62.1,84.29 61.04,85.34 v60.96,85.34 | U3.3 62.56,70.18 v62.48,70.1 | U3.10 65.16,63.87 65.13,63.83 v65.13,63.75 | v60.21,63.74 v58.18,63.74 v58.17,63.75 | U2.3 61.9,56.21 61.72,56.39 v61.72,56.35 | v62.48,60.96 v62.48,62.48 | U2.10 65.16,49.95 65.15,49.94 v65.15,49.78 | U1.10 65.16,35.73 65.18,35.71 v65.15,35.71 | v62.23,42.16 62.31,42.24 U1.3 | v61.98,48.51 v61.98,46.74
  Top 0.813: C19.1 7.49,52 7.49,52.45 v7.43,52.45 | C21.1 5.87,29.62 7.49,31.24 7.49,32.26 v7.43,32.26 | C20.1 8.74,70.59 9.78,71.63 v9.75,71.66 | X1.11 X1.1
  Top 1.27: C13.+ 45.67,9.78 X1.2 | C14.+ 41.3,12 X1.1
  Bottom 0.305: v13.46,24.13 v18.54,24.13 v23.62,24.13 v28.45,24.13
  Bottom 0.406: v65.15,77.7 63.59,76.45 v51.71,76.45 | v60.96,85.34 v51.05,85.34 | v62.48,70.1 62.46,70.08 v51.82,70.08 51.82,64.26 52.32,63.75 | v65.13,63.75 61.21,63.75 | v60.21,63.74 60.2,63.75 61.21,63.75 | v58.17,63.75 52.32,63.75 | v61.72,56.35 61.86,56.49 62,56.49 62.89,57.38 62.89,58.69 62.48,59.1 v62.48,60.96 | v62.48,62.48 61.21,63.75 | v65.15,49.78 62.05,49.78 | 62.05,49.78 61.57,50.27 52.09,50.27 50.39,51.97 50.39,61.82 52.32,63.75 | v65.15,35.71 64.31,36.55 64.31,39.35 62.23,41.43 v62.23,42.16 61.98,42.42 62.08,42.52 62.76,42.52 63.14,42.91 63.14,44.47 61.98,45.64 v61.98,46.74 | 62.05,49.78 62.05,48.34 62.03,48.31 61.98,48.31 v61.98,48.51
  Bottom 0.61: v13.46,24.13 8.38,24.13 7.37,25.15 7.37,27.18 7.11,27.43 7.11,28.38 PTC1.P$1 v7.43,32.26 PTC2.P$1 v7.43,52.45 PTC3.P$1 v9.75,71.66 12.04,73.95 12.04,89.44 13.79,91.19 49.28,91.19 50.04,90.42 50.04,86.04 50.74,85.34 v51.05,85.34
  Bottom 0.813: PTC1.P$1 7.43,9.88 5.97,8.41 5.97,6.2 6.81,5.36 10.21,5.36 12.62,7.78 39.97,7.78 41.3,9.1 X1.1 X1.2
D2_A  (via drill 0.3)
  Top 0.406: v34.61,59.75 R9.1
  Bottom 0.406: JP3.3 32.45,59.75 v34.61,59.75
D2_B
  Top 0.406: JP3.6 33.66,68.58 R3.1
D2_C
  Top 0.406: JP5.3 R15.1
D2_D
  Top 0.406: JP5.6 R21.1
ENC_1A  (via drill 0.35)
  Top 0.305: 29.28,14.54 R27.1 29.21,16.32 v29.21,17.78 | JP3.1 32,47.37 32,28 30.48,26.48 v30.48,20.32
  Top 0.406: 29.28,14.54 Q2.2
  Bottom 0.305: v30.48,20.32 29.21,19.05 v29.21,17.78
ENC_1B
  Top 0.305: JP1.7 31.09,43.2 31.09,30.06 25.78,24.75 25.78,18.57 27.18,17.17 27.18,13.72 26.85,13.39 25.6,13.39 24.32,14.67 R25.1
  Top 0.406: Q1.2 24.32,14.67
ENC_2A
  Top 0.305: JP1.5 27.43,39.5 27.43,37.63 28.36,36.7 29.05,36.7 29.72,36.03 29.72,32.55 28.79,31.62 22.73,31.62 15.19,24.08 15.19,20.04 15.86,19.37 18.33,19.37 19.14,18.57 19.14,16.15 R31.1
  Top 0.406: Q4.2 R31.1
ENC_2B
  Top 0.305: JP1.3 21.84,35.56 9.23,22.95 9.23,19.95 9.74,19.43 13.35,19.43 14.25,18.53 14.25,16.3 R29.1
  Top 0.406: R29.1 Q3.2
ENC_3A
  Top 0.305: JP1.8 31.55,45.29 31.55,28.2 26.74,23.38 R35.1 26.86,22.48 Q6.2
ENC_3B
  Top 0.305: JP1.6 30.63,41.12 30.63,30.27 27.75,27.39 25.92,27.39 21.83,23.31 R33.1 21.78,22.58 Q5.2
ENC_4A
  Top 0.305: JP1.4 30.18,36.5 30.18,30.46 28.11,28.4 21.84,28.4 16.58,23.13 16.58,22.86 | 16.58,22.86 R39.1 | Q8.2 16.7,22.73 16.58,22.86
ENC_4B
  Top 0.305: JP1.2 21.39,33.02 11.5,23.13 R37.1 11.5,20.56 Q7.2
FB1
  Top 0.305: R4.2 R10.2 30.19,53.34 28.92,54.61 17.14,54.61 JP4.8
FB2
  Top 0.406: R22.2 R16.2 33.42,57.07 17.07,57.07 JP4.7
GND  (via drill 0.3, 0.35, 0.65 pad 1.3)
  Top 0.152: U3.33 65.96,66.98
  Top 0.406: 68.36,53.81 68.2,53.98 U2.33 | U2.25 U2.26 | U1.19 U1.18 | v65.53,68.58 U3.33 68.83,68.58 69.63,69.38 | 65.53,66.98 65.96,66.98 66.04,67.06 | 69.16,66.98 68.83,67.31 | U3.19 U3.18 U3.17 | 69.67,70.18 69.6,70.1 | U3.26 U3.25 U3.24 U3.23 | U3.9 63.75,64.77 v62.23,64.77 | C9.- 53.37,66.29 v54.61,66.29 | C11.- 53.37,52.32 v54.61,52.32 | C12.- 54.58,38.32 v54.61,38.35 | U2.9 63.75,50.8 v62.48,50.8 | U1.9 63.75,36.83 v62.23,36.83 | R6.1 C2.2 v33.27,45.72 | C8.2 R24.1 C6.2 R18.1 C4.2 R12.1 v42.93,50.8 | U1.5 v65.53,40.64 | v66.55,39.62 66.29,39.12 65.79,39.12 65.71,39.04 U1.7
  Top 0.61: U4.7 65.1,80.95 v65.53,80.52 | v65.53,82.55 U4.5 | U4.26 U4.25 U4.24 U4.23 70.03,84.15 v69.6,84.58 | U4.22 69.38,83.35 69.34,83.31 68.83,83.31 68.07,82.55 | 68.07,82.55 U4.33 | U4.20 68.54,81.75 68.33,81.53 | 68.33,81.53 68.07,81.79 68.07,82.55 | 68.33,81.53 68.33,81.03 68.4,80.95 U4.19 U4.18 U4.17 | U4.9 arc45 63.52,78.99 v62.48,78.99 | C10.- 53.43,79.76 v54.61,79.76 | U2.7 65.1,53.01 v65.53,52.58 | U2.5 v65.53,54.61 | U2.23 70.03,56.21 v69.6,56.64 | U2.22 69.38,55.41 69.34,55.37 69.6,55.12 v69.6,54.61 | U2.20 68.36,53.81 | U2.19 68.91,53.01 68.83,53.09 68.33,53.09 68.33,53.85 68.2,53.98 | U3.20 69.38,67.78 69.34,67.82 68.83,67.31 | U3.19 69.16,66.98 | U3.22 69.63,69.38 | U3.23 69.67,70.18 | U3.5 v65.53,68.58 | U3.7 65.53,66.98 | U1.20 68.8,39.84 v68.58,39.62 | U1.19 69.16,39.04 69.09,39.12 v68.58,38.61 | U1.22 68.8,41.44 v68.58,41.66 | U1.23 68.91,42.24 68.83,42.16 68.58,42.42 v68.58,42.67 | U1.26 69.93,44.3 69.93,43.35 69.6,43.02 v69.6,41.66 | U1.17 U1.18
  Top 0.813: C19.2 3.56,50.45 1.85,52.16 1.85,53.25 3.17,54.57 PMOD_B.9 | PMOD_A.9 3.17,34.25 1.85,32.93 1.85,31.19 C21.2 | PMOD_C.9 3.17,74.89 1.85,73.57 1.85,72.16 C20.2 | C22.2 22.02,37.34 v23.62,37.34 | ENC.14 15.79,3.05 17.11,1.73 23.28,1.73 24.6,3.05 ENC.6 | C17.2 71.88,91.95
  Top 1.27: C14.- v37.4,24.27 v37.41,24.28 | C13.- 45.67,24.26 v45.7,24.26 | v53.92,24.26 C15.- | C18.2 86.17,14.03 v87.77,14.03
  Bottom 0.152: v72.64,39.12 72.39,38.86 71.37,38.86
  Bottom 0.406: v62.23,64.77 62.23,67.31 | v62.48,50.8 63.75,52.07 63.75,53.09 | 53.09,51.82 53.59,52.32 v54.61,52.32 | v33.27,45.72 33.02,45.72
  Bottom 0.61: v62.48,78.99 63.65,80.16 arc-45 64.01,81.03
  Bottom 0.813: 23.88,37.34 v23.62,37.34 25.4,35.56 25.4,31.24 26.16,30.48 JP1.1
  other vias: 67.56,82.55 65.53,84.58 67.56,84.58 69.6,82.55 69.6,80.52 67.56,80.52 67.56,40.64 67.56,54.61 67.56,68.58 65.53,70.61 67.56,70.61 69.6,70.61 69.6,68.58 69.6,66.55 67.56,66.55 65.53,66.55 67.56,56.64 65.53,56.64 69.6,52.58 67.56,52.58 69.6,42.67 67.56,42.67 65.53,42.67 65.53,38.61 69.6,38.61 69.6,40.64 67.56,38.61 72.64,84.33 72.64,83.31 72.64,82.04 72.64,81.03 72.64,80.01 73.66,80.01 73.66,81.03 73.66,82.04 73.66,83.31 73.66,84.33 73.66,85.34 72.64,85.34 74.68,85.34 74.68,84.33 74.68,83.31 74.68,82.04 74.68,81.03 74.68,80.01 66.55,84.58 68.58,84.58 68.58,82.55 69.6,83.57 68.58,83.57 67.56,83.57 66.55,83.57 65.53,83.57 66.55,82.55 65.53,81.53 66.55,80.52 66.55,81.53 67.56,81.53 68.58,81.53 69.6,81.53 68.58,80.52 66.55,70.61 66.55,68.58 66.55,66.55 68.58,66.55 68.58,68.58 69.6,67.56 68.58,67.56 67.56,67.56 66.55,67.56 65.53,67.56 65.53,69.6 66.55,69.6 67.56,69.6 68.58,69.6 69.6,69.6 68.58,70.61 72.64,70.36 72.64,69.34 72.64,68.07 72.64,67.06 72.64,66.04 73.66,66.04 73.66,67.06 73.66,68.07 73.66,69.34 73.66,70.36 73.66,71.37 72.64,71.37 74.68,71.37 74.68,70.36 74.68,69.34 74.68,68.07 74.68,67.06 74.68,66.04 72.69,56.29 72.69,55.27 72.69,54 72.69,52.98 72.69,51.97 73.71,51.97 73.71,52.98 73.71,54 73.71,55.27 73.71,56.29 73.71,57.3 72.69,57.3 74.73,57.3 74.73,56.29 74.73,55.27 74.73,54 74.73,52.98 74.73,51.97 72.64,42.42 72.64,41.4 72.64,40.13 72.64,38.1 73.66,38.1 73.66,39.12 73.66,40.13 73.66,41.4 73.66,42.42 73.66,43.43 72.64,43.43 74.68,43.43 74.68,42.42 74.68,41.4 74.68,40.13 74.68,39.12 74.68,38.1 69.57,53.57 68.55,52.55 66.52,52.55 65.51,53.57 67.54,53.57 66.52,53.57 68.55,53.57 68.55,54.58 66.52,54.58 66.52,55.6 67.54,55.6 68.55,55.6 69.57,55.6 68.55,56.62 66.52,56.62 65.51,55.6 66.55,42.67 65.53,41.66 65.53,39.62 67.56,39.62 69.6,39.62 66.55,38.61 66.55,40.64 68.58,40.64 67.56,41.66 66.55,41.66 74.93,93.98 72.39,90.17 89.15,93.98 93.73,88.65 76.96,54.86 76.96,56.9 77.22,70.87 77.22,68.33 77.22,82.3 77.22,84.84 93.98,68.33 93.98,82.55 93.98,74.93 93.98,54.61 93.98,60.71 93.98,40.64 93.98,47.5 93.98,33.78 93.98,13.97 93.98,20.57 93.98,26.92 88.65,26.92 88.65,33.53 83.57,33.78 77.22,42.93 77.22,40.13 81.03,93.98 81.03,90.42 86.87,88.39 87.12,75.18 86.87,60.96 86.61,47.5 87.8,8.24 93.22,8.13 87.92,1.19
  pour Bottom: 70.1,80.01 70.1,84.58 55.63,84.58 52.58,81.53 52.58,78.23 68.33,78.23
  pour Bottom: 70.1,65.53 70.1,70.87 55.63,70.87 52.58,67.82 52.58,64.52 69.09,64.52
  pour Bottom: 70.1,52.32 70.1,56.9 55.63,56.9 52.58,53.85 52.58,50.55 68.33,50.55
  pour Bottom: 70.1,38.35 70.1,42.93 55.63,42.93 52.58,39.88 52.58,36.58 68.33,36.58
  pour Top (isolate 0.406, no thermals): 95.25,-0.25 95.25,94.49 94.23,95.5 71.63,95.5 71.63,38.48 86.79,23.32 86.79,-0.25
  pour Bottom (isolate 0.406): 0.25,-0.25 0.25,95.5 0.51,95.76 94.74,95.76 95,95.5 96.52,93.98 96.52,0.51 96.52,-0.51 0.51,-0.51
IN1_A
  Top 0.406: JP3.4 33.66,63.5 R7.1
IN1_B
  Top 0.406: JP5.1 R1.1
IN1_C
  Top 0.406: JP5.4 R13.1
IN1_D
  Top 0.406: JP5.7 R19.1
IN2_A
  Top 0.406: JP3.5 33.66,66.04 R8.1
IN2_B
  Top 0.406: JP5.2 R2.1
IN2_C
  Top 0.406: JP5.5 R14.1
IN2_D
  Top 0.406: JP5.8 R20.1
MOUTA  (via drill 0.35)
  Top 0.61: U2.12 66.76,49.04 v66.98,48.82 | U2.13 v67.56,49.53 | U2.14 68.36,48.86 v68.45,48.77 | U2.15 69.16,49.61 v69.09,49.53
  Bottom 0.406: 69.09,48.77 v69.09,49.53 | 67.56,48.77 v67.56,49.53
  Bottom 0.61: v66.98,48.82 67.04,48.77 67.56,48.77 | v68.45,48.77 69.09,48.77
  Bottom 2.54: B.- 76.46,49.53 v69.09,49.53 v67.56,49.53
MOUTB  (via drill 0.35)
  Top 0.61: U2.30 66.76,60.03 v67.18,60.45 | U2.29 v67.56,59.69 | U2.28 68.36,60.24 v68.45,60.33 | U2.27 69.16,59.61 v69.09,59.69
  Bottom 0.61: v67.18,60.45 67.18,60.07 v67.56,59.69 67.82,59.69 v68.45,60.33
  Bottom 2.54: B.+ 83.56,59.69 v69.09,59.69 v67.56,59.69
N$1  (via drill 0.3)
  Top 0.406: R3.2 36.58,68.58 v36.58,67.31 | U2.16 69.85,50.8 v69.85,47.75
  Bottom 0.406: v69.85,47.75 41.83,47.75 39.9,49.68 39.35,49.68 39.12,49.45 28.02,49.45 27.18,50.29 27.18,66.55 27.94,67.31 v36.58,67.31
N$2
  Bottom 0.813: PTC4.P$2 13.78,30.92 JP2.8
N$3
  Bottom 0.61: PMOD_A.12 PMOD_A.11 3.17,28.76 PTC1.P$2
N$4  (via drill 0.3)
  Top 0.406: v56.13,46.48 56.07,46.48 56.03,46.52 56.03,52.65 54.29,54.4 52.6,54.4 41.31,65.68 36.87,65.68 R8.2 | v62.23,44.45 62.34,44.34 U1.1
  Bottom 0.406: v56.13,46.48 58.17,44.45 v62.23,44.45
N$5
  Bottom 0.61: PMOD_C.12 PMOD_C.11 | 3.17,69.4 PTC3.P$2
  Bottom 0.813: PMOD_C.11 3.17,69.4
N$6  (via drill 0.3)
  Top 0.406: R2.2 46.99,73.66 48.26,72.39 48.26,67.5 51.82,63.94 v51.82,62.23 | U2.1 63.75,58.42 v62.23,58.42
  Bottom 0.406: v62.23,58.42 59.49,61.16 52.71,61.16 51.92,61.96 51.92,62.23 v51.82,62.23
N$7  (via drill 0.3)
  Top 0.406: R1.2 43.62,71.12 51.05,63.69 v51.05,61.21 | U2.2 61.86,57.01 v61.72,57.15
  Bottom 0.406: v51.05,61.21 51.66,60.6 59.18,60.6 61.57,58.22 61.57,58.15 61.72,57.99 v61.72,57.15
N$8
  Top 0.305: ENC.1 R28.1 30.35,8.24 31.41,9.29 31.41,10.85 30.35,11.9 Q2.3
N$9
  Top 0.305: Q5.3 22.73,11.93 23.79,10.87 23.79,9.32 22.73,8.26 R34.1 22.73,8.13 24.21,6.66 25.71,6.66 26.34,6.03 26.34,4.52 ENC.4
N$10  (via drill 0.3)
  Top 0.406: R7.2 36.76,63.25 v38.1,63.25 | v44.7,60.71 v46.74,58.67 49.28,56.13 v49.28,52.07 | v49.28,48.77 v49.28,46.74 | U1.2 62.52,43.04 62.48,43.08 v62.48,43.18
  Bottom 0.406: v38.1,63.25 42.16,63.25 v44.7,60.71 | v49.28,52.07 v49.28,48.77 | v49.28,46.74 49.28,44.2 50.55,42.93 50.8,43.18 v62.48,43.18
N$11
  Bottom 0.61: PMOD_B.12 PMOD_B.11 3.17,49.08 PTC2.P$2
N$12
  Top 0.406: U2.32 65.16,59.55 64.07,60.64 C1.2
N$13  (via drill 0.35)
  Top 0.61: U1.12 66.76,35.22 v67.06,34.92 | U1.13 v67.56,35.56 | U1.14 68.36,35.14 v68.58,34.92 | U1.15 69.16,35.61 v69.22,35.56
  Bottom 0.61: v67.06,34.92 67.56,35.43 v67.56,35.56 | v68.58,34.92 68.33,34.92 67.69,35.56
  Bottom 2.54: A.- 76.46,35.56 v69.22,35.56 67.69,35.56 v67.56,35.56
N$14  (via drill 0.3)
  Top 0.305: C2.1 R6.2 R4.1
  Top 0.406: v55.37,51.05 54.36,50.04 49.78,50.04 47.75,52.07 v42.93,52.07 | U2.8 62.34,52.21 v62.23,52.32 | v38.1,52.07 37.78,52.07 R4.1
  Bottom 0.406: v55.37,51.05 61.21,51.05 62.23,52.07 v62.23,52.32 | v42.93,52.07 v38.1,52.07
N$15
  Bottom 0.61: ENC.16 ENC.15 | ENC.16 8.45,3.05 PTC5.P$2 | ENC.7 ENC.8 22.73,2.16 21.84,1.27 14.35,1.27 ENC.16
N$16
  Top 0.406: LED1.A R5.2
N$17  (via drill 0.35)
  Top 0.61: U1.30 66.76,46.06 v67.18,46.48 | v67.56,45.72 U1.29 | U1.28 68.36,46.14 v68.58,46.35 | U1.27 69.16,45.54 v69.34,45.72
  Bottom 0.61: v67.18,46.48 67.56,46.1 v67.56,45.72 67.94,45.72 v68.58,46.35
  Bottom 2.54: A.+ 83.56,45.72 v69.34,45.72 v67.56,45.72
N$19
  Top 0.406: U1.32 65.16,45.64 64.21,46.6 64.21,47.62 C3.2
N$20  (via drill 0.3)
  Top 0.406: R9.2 v38.1,60.96 | v43.18,60.71 v45.97,57.91 | v48.51,33.02 48.01,33.53 v48.01,48.77 | v70.36,32.77 69.96,33.16 U1.16
  Bottom 0.406: v38.1,60.96 42.93,60.96 v43.18,60.71 | v45.97,57.91 48.01,55.88 v48.01,48.77 | v48.51,33.02 48.84,32.69 70.28,32.69 v70.36,32.77
N$24  (via drill 0.3)
  Top 0.305: R10.1 C4.1 R12.2
  Top 0.406: U1.8 62.62,38.24 62.61,38.25 v62.56,38.25 | v39.62,49.02 39.62,50.73 R12.2
  Bottom 0.406: v62.56,38.25 57.05,38.25 54.36,35.56 42.42,35.56 39.62,38.35 v39.62,49.02
N$27  (via drill 0.3)
  Top 0.406: v50.04,72.14 50.04,79.5 48.51,81.03 36.76,81.03 R14.2 | v62.23,72.39 62.34,72.28 U3.1
  Bottom 0.406: v62.23,72.39 61.98,72.14 v50.04,72.14
N$28  (via drill 0.3)
  Top 0.406: R13.2 36.76,78.49 47.5,78.49 49.38,76.61 49.38,71.86 50.04,71.2 v50.04,70.87 | v62.2,70.99 62.22,70.98 U3.2
  Bottom 0.406: v50.04,70.87 50.16,70.74 61.95,70.74 v62.2,70.99
N$29  (via drill 0.35)
  Top 0.61: U3.12 66.76,63.16 v67.06,62.87 | U3.13 v67.56,63.5 | U3.14 68.36,63.21 v68.58,62.99 | U3.15 69.16,63.55 v69.22,63.5
  Bottom 0.406: 67.06,63.5 v67.56,63.5
  Bottom 0.61: v67.06,62.87 67.06,63.5 | v68.58,62.99 68.07,63.5 v67.56,63.5
  Bottom 2.54: C.- 76.46,63.5 v69.22,63.5 v67.56,63.5
N$30  (via drill 0.35)
  Top 0.61: U3.30 66.76,74.13 v67.06,74.42 | U3.29 v67.56,73.66 | U3.28 68.36,74.08 v68.58,74.3 | U3.27 69.16,73.61 v69.22,73.66
  Bottom 0.61: v67.06,74.42 67.06,74.17 v67.56,73.66 68.2,74.3 v68.58,74.3
  Bottom 2.54: C.+ 83.56,73.66 v69.22,73.66 v67.56,73.66
N$32
  Top 0.406: U3.32 65.16,73.58 64.21,74.54 64.21,75.56 C5.2
N$33  (via drill 0.3)
  Top 0.406: R15.2 47.24,76.2 48.82,74.62 48.82,67.73 52.58,63.97 v52.58,62.23 | v70.1,61.72 69.96,61.86 U3.16
  Bottom 0.406: v52.58,62.23 53.09,61.72 v70.1,61.72
N$37  (via drill 0.3)
  Top 0.305: R16.1 R18.2 C6.1
  Top 0.406: U3.8 61.71,66.18 v61.57,66.04 | v53.59,62.48 53.24,62.13 53.24,61.96 51.73,60.45 v49.53,60.45 | v39.88,59.69 39.69,59.5 C6.1
  Bottom 0.406: v61.57,66.04 58.01,62.48 v53.59,62.48 | v49.53,60.45 48.77,59.69 v39.88,59.69
N$40  (via drill 0.3)
  Top 0.406: v51.05,88.65 36.76,88.65 R20.2 | v63.5,87.88 63.86,87.52 U4.1
  Bottom 0.406: v51.05,88.65 62.74,88.65 v63.5,87.88
N$41  (via drill 0.3)
  Top 0.406: v51.05,86.11 36.76,86.11 R19.2 | U4.2 62.37,84.95 v62.23,85.09
  Bottom 0.406: v51.05,86.11 61.21,86.11 v62.23,85.09
N$42  (via drill 0.35)
  Top 0.61: U4.12 66.76,77.13 v67.06,76.83 | U4.13 v67.56,77.47 | U4.14 68.36,76.87 v68.33,76.83 | U4.15 69.16,77.52 v69.22,77.47
  Bottom 0.61: v67.06,76.83 67.56,77.34 v67.56,77.47 67.69,77.47 v68.33,76.83
  Bottom 2.54: D.- 76.46,77.47 v69.22,77.47 v67.56,77.47
N$43  (via drill 0.35)
  Top 0.61: U4.29 v67.56,87.63 | U4.30 66.76,87.97 v67.06,88.27 | U4.28 68.36,88.05 68.45,88.14 v68.45,88.27 | U4.27 69.16,87.58 v69.22,87.63
  Bottom 0.61: v67.06,88.27 67.56,87.76 v67.56,87.63 68.2,88.27 v68.45,88.27
  Bottom 2.54: D.+ 83.56,87.63 v69.22,87.63 v67.56,87.63
N$45
  Top 0.406: U4.32 65.16,87.55 64.21,88.51 64.21,89.53 C7.2
N$46  (via drill 0.3)
  Top 0.406: R21.2 36.76,83.57 v51.05,83.57 v51.05,75.44 | U4.16 69.96,76.31 v69.34,75.69
  Bottom 0.406: v69.34,75.69 69.09,75.44 v51.05,75.44
N$50  (via drill 0.3)
  Top 0.305: R22.1 37.15,58.42 R24.2 C8.1
  Top 0.406: 63.82,80.11 62.52,80.11 61.72,79.31 v61.72,77.47 | v39.62,65.02 39.62,63.57 C8.1
  Top 0.61: U4.8 63.82,80.11
  Bottom 0.406: v61.72,77.47 40.64,77.47 39.62,76.45 v39.62,65.02
N$53
  Top 0.305: ENC.3 25.27,8.13 R26.1 25.27,8.26 26.33,9.32 26.33,10.87 25.27,11.93 Q1.3
N$54
  Top 0.305: ENC.2 30.35,4.08 29.29,5.15 29.29,6.7 R36.1 28.84,9.25 28.84,10.87 27.81,11.9 Q6.3
N$55
  Top 0.305: Q3.3 15.27,12.03 16.3,11 16.3,9.38 R30.1 17.65,5.91 ENC.11
N$56
  Top 0.305: Q4.3 20.09,12.03 21.12,11 21.12,9.38 R32.1 20.07,5.71 ENC.9
N$57
  Top 0.305: Q7.3 12.57,12.05 13.63,11 13.63,9.45 12.57,8.39 R38.1 14.24,6.66 15.55,6.66 16.18,6.03 16.18,4.71 17.65,3.24 ENC.12
N$58
  Top 0.305: Q8.3 17.65,12.05 18.71,11 18.71,9.45 17.65,8.39 R40.1 17.65,7.1 18.72,6.03 18.72,4.52 ENC.10
PMOD_A1
  Top 0.406: PMOD_A.1 3.17,45.14 7.49,49.45 17.07,49.45 20.95,53.34 JP3.2
PMOD_A2
  Top 0.406: JP2.1 10.16,45.09 PMOD_A.2
PMOD_A3
  Top 0.406: JP2.2 11.38,43.76 4.39,43.76 PMOD_A.3
PMOD_A4
  Top 0.406: JP2.3 12.83,42.67 5.84,42.67 PMOD_A.4
PMOD_A5
  Top 0.406: JP2.4 12.72,41.25 4.42,41.25 PMOD_A.5
PMOD_A6
  Top 0.406: JP2.5 12.06,38.1 10.16,40.01 PMOD_A.6
PMOD_A7
  Top 0.406: PMOD_A.7 4.45,38.73 8.89,38.73 12.06,35.56 JP2.6
PMOD_A8
  Top 0.406: JP2.7 12.06,33.02 7.62,37.47 PMOD_A.8
PMOD_B1
  Top 0.406: PMOD_B.1 3.17,66.67 5.08,68.58 JP4.1
PMOD_B2
  Top 0.406: PMOD_B.2 6.35,65.41 8.33,67.39 27.38,67.39 JP3.8
PMOD_B3
  Top 0.406: JP4.2 11.43,66.04 9.53,64.14 4.45,64.14 PMOD_B.3
PMOD_B4
  Top 0.406: PMOD_B.4 10.16,62.87 12.06,64.77 27.3,64.77 JP3.7
PMOD_B5
  Top 0.406: PMOD_B.5 4.45,61.59 11.43,61.59 JP4.3
PMOD_B6
  Top 0.406: PMOD_B.6 5.84,60.45 12.95,60.45 13.34,60.83 JP4.4
PMOD_B7
  Top 0.406: PMOD_B.7 4.32,58.93 12.83,58.93 JP4.5
PMOD_B8
  Top 0.406: JP4.6 13.46,55.88 11.56,57.78 PMOD_B.8
PMOD_C1
  Top 0.406: PMOD_C.1 4.13,85.72 5.25,86.84 11.28,86.84 JP6.1
PMOD_C2
  Top 0.406: PMOD_C.2 6.35,85.09 12.06,85.09 JP6.2
PMOD_C3
  Top 0.406: JP6.3 12.83,84.33 4.32,84.33 PMOD_C.3
PMOD_C4
  Top 0.406: PMOD_C.4 6.35,82.55 12.06,82.55 JP6.4
PMOD_C5
  Top 0.406: JP6.5 10.16,81.92 4.45,81.92 PMOD_C.5
PMOD_C6
  Top 0.406: PMOD_C.6 8.89,80.64 JP6.6
PMOD_C7
  Top 0.406: PMOD_C.7 4.45,79.38 8.26,79.38 13.34,74.3 JP6.7
PMOD_C8
  Top 0.406: JP6.8 13.34,71.75 6.99,78.11 PMOD_C.8

### Text on the board
tPlace: 10/1/2018 | Nikki Raeburn | Charlie Mehlenbeck | Stellix R1
tNames: Team Drop Out